# EAGLE design robber_v01 (EAGLE 7.7.0)
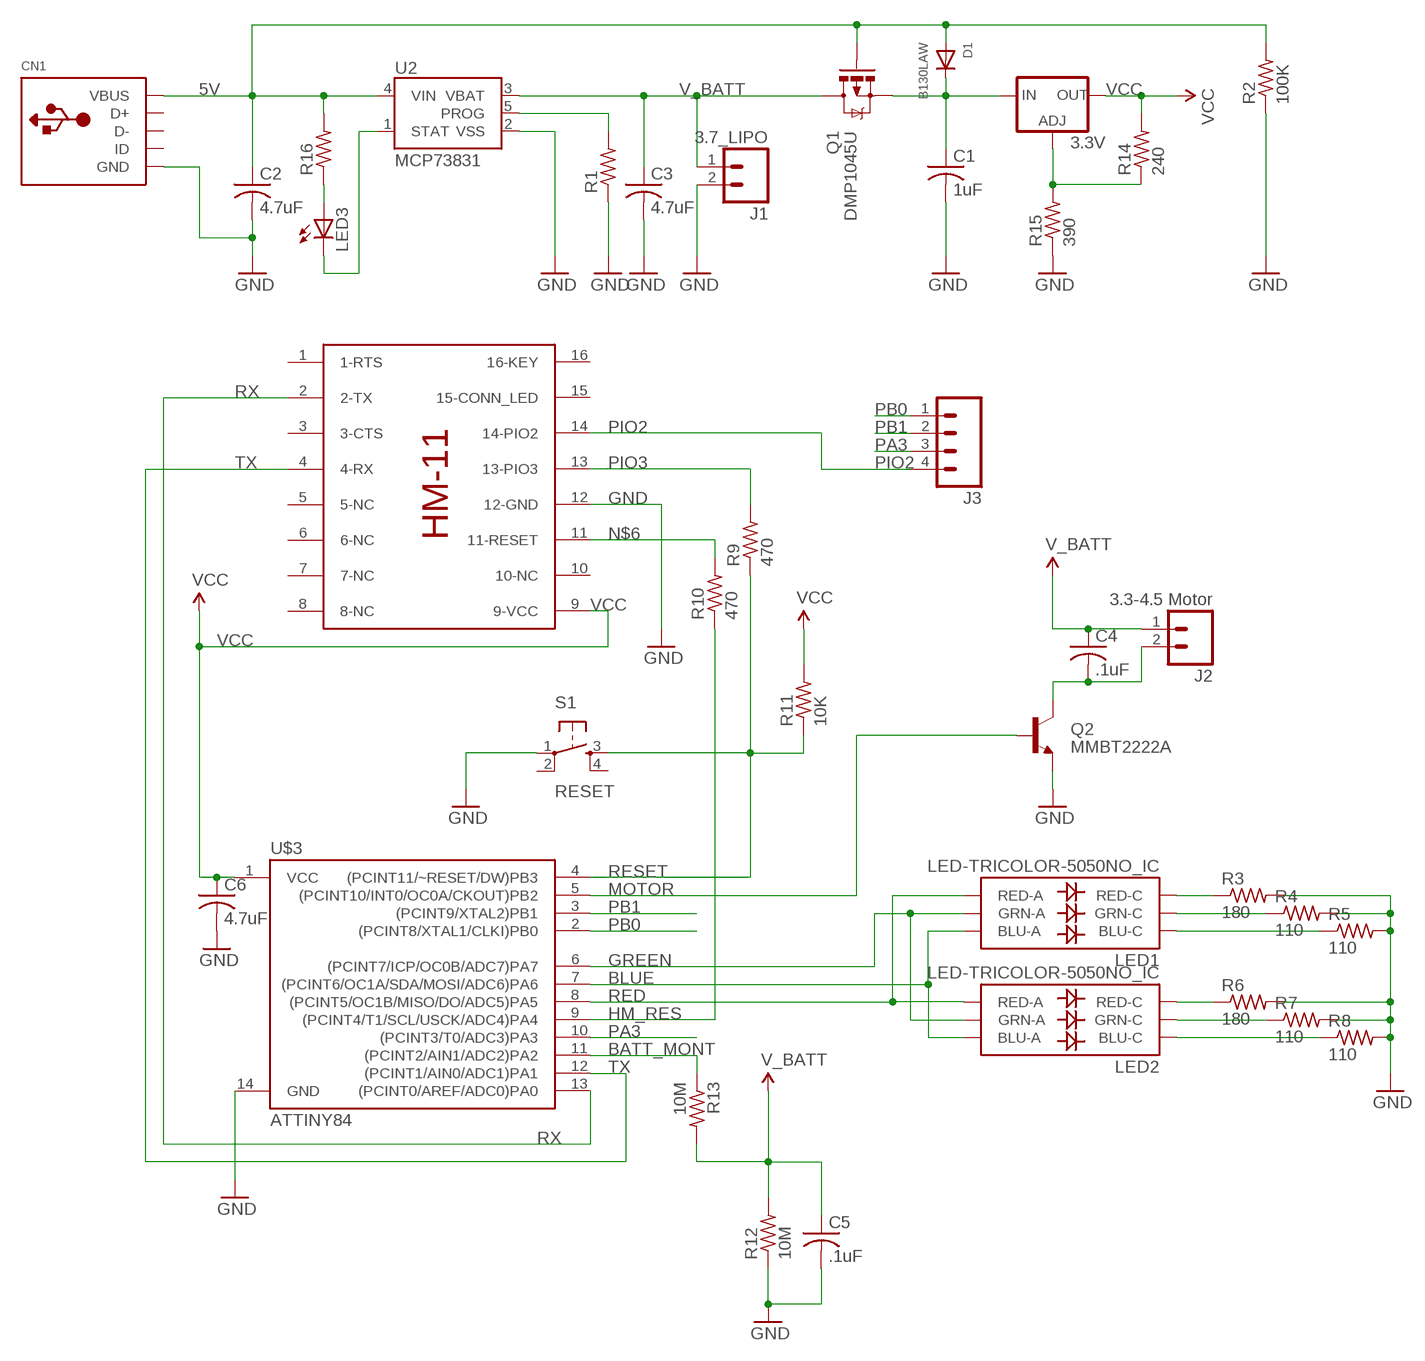
[diagram p0: schematic, sheet 1]

## Parts
3.3V  V_REG_317SMD  [SOT223]
C1  1uF  C-USC0805  [C0805]
C2  4.7uF  C-USC0805  [C0805]
C3  4.7uF  C-USC0805  [C0805]
C4  .1uF  C-USC0805  [C0805]
C5  .1uF  C-USC0805  [C0805]
C6  4.7uF  C-USC0805  [C0805]
CN1  USBMINIB  [USB-MINIB]
D1  B130LAW  DIODESOD-123  [SOD-123]
J1  3.7_LIPO  M02PTH  [1X02]
J2  3.3-4.5 Motor  M02PTH  [1X02]
J3  M04PTH  [1X04]
LED1  LED-TRICOLOR-5050NO_IC  [LED-TRICOLOR-5050]
LED2  LED-TRICOLOR-5050NO_IC  [LED-TRICOLOR-5050]
LED3  LEDSML0603  [SML0603]
Q1  DMP1045U  MOSFET-PCHANNEL  [SOT23-3]
Q2  MMBT2222A  TRANSISTOR_NPNMMBT2222A  [SOT23-3]
R1  R-US_R0805  [R0805]
R2  100K  R-US_R0805  [R0805]
R3  180  R-US_R0805  [R0805]
R4  110  R-US_R0805  [R0805]
R5  110  R-US_R0805  [R0805]
R6  180  R-US_R0805  [R0805]
R7  110  R-US_R0805  [R0805]
R8  110  R-US_R0805  [R0805]
R9  470  R-US_R0805  [R0805]
R10  470  R-US_R0805  [R0805]
R11  10K  R-US_R0805  [R0805]
R12  10M  R-US_R0805  [R0805]
R13  10M  R-US_R0805  [R0805]
R14  240  R-US_R0805  [R0805]
R15  390  R-US_R0805  [R0805]
R16  R-US_R0805  [R0805]
S1  RESET  TAC_SWITCHSMD  [TACTILE-SWITCH-SMD]
U2  MCP73831  [SOT23-5]
U$1  HM-11  [HM-11]
U$3  ATTINY84  [SO14]

## Nets
5V: C2.1 CN1.VBUS D1.A Q1.1(G) R2.2 R16.2 U2.4(VIN)
BATT_MONT: R13.1 U$3.11((PCINT2/AIN1/ADC2)PA2)
BLUE: LED1.3(BLU-A) LED2.3(BLU-A) U$3.7((PCINT6/OC1A/SDA/MOSI/ADC6)PA6)
GND: C1.2 C2.2 C3.2 C5.2 C6.2 CN1.GND CN1.GND1(GND) CN1.GND2(GND) CN1.GND3(GND) CN1.GND4(GND) J1.2 Q2.2(E) R1.1 R2.1 R3.2 R4.2 R5.2 R6.2 R7.2 R8.2 R12.1 R15.1 S1.1 U2.2(VSS) U$1.12(12-GND) U$3.14(GND)
GREEN: LED1.1(GRN-A) LED2.1(GRN-A) U$3.6((PCINT7/ICP/OC0B/ADC7)PA7)
HM_RES: R10.1 U$3.9((PCINT4/T1/SCL/USCK/ADC4)PA4)
MOTOR: Q2.1(B) U$3.5((PCINT10/INT0/OC0A/CKOUT)PB2)
N$1: LED3.A R16.1
N$2: LED3.C U2.1(STAT)
N$6: R10.2 U$1.11(11-RESET)
N$7: C4.2 J2.2 Q2.3(C)
N$9: 3.3V.1(ADJ) R14.1 R15.2
N$18: LED1.5(RED-C) R3.1
N$19: 3.3V.3(IN) C1.1 D1.C Q1.2(S)
N$20: R1.2 U2.5(PROG)
N$21: LED1.6(GRN-C) R4.1
N$23: LED1.4(BLU-C) R5.1
N$27: LED2.5(RED-C) R6.1
N$28: LED2.6(GRN-C) R7.1
N$29: LED2.4(BLU-C) R8.1
PA3: J3.3 U$3.10((PCINT3/T0/ADC3)PA3)
PB0: J3.1 U$3.2((PCINT8/XTAL1/CLKI)PB0)
PB1: J3.2 U$3.3((PCINT9/XTAL2)PB1)
PIO2: J3.4 U$1.14(14-PIO2)
PIO3: R9.2 U$1.13(13-PIO3)
RED: LED1.2(RED-A) LED2.2(RED-A) U$3.8((PCINT5/OC1B/MISO/DO/ADC5)PA5)
RESET: R9.1 R11.1 S1.3 U$3.4((PCINT11/~RESET/DW)PB3)
RX: U$1.2(2-TX) U$3.13((PCINT0/AREF/ADC0)PA0)
TX: U$1.4(4-RX) U$3.12((PCINT1/AIN0/ADC1)PA1)
V_BATT: C3.1 C4.1 C5.1 J1.1 J2.1 Q1.3(D) R12.2 R13.2 U2.3(VBAT)
VCC: 3.3V.2(OUT) C6.1 R11.2 R14.2 U$1.9(9-VCC) U$3.1(VCC)
Unconnected: CN1.D+ CN1.D- CN1.ID S1.2 S1.4 U$1.1(1-RTS) U$1.3(3-CTS) U$1.5(5-NC) U$1.6(6-NC) U$1.7(7-NC) U$1.8(8-NC) U$1.10(10-NC) U$1.15(15-CONN_LED) U$1.16(16-KEY)

## Library data of the parts
3.3V = SparkFun-PowerIC:V_REG_317: Voltage Regulator Standard LM317 adjustable voltage regulator. AOI (Adjust Output Input). Google 'LM317 Calculator' for easy to use app to get the two resistor values needed. 240/720 for 5V output. 240/390 for 3.3V output. Spark Fun Electronics SKU : COM-00527
C1-C6 = resistor:C-US: CAPACITOR, American symbol
CN1 = adafruit:USB: USB Connectors USBMINIB - Surface Mount Female Mini-B USB Connector 4UConnector: 06564 By microbuilder.eu Thru-hole RA Female Mini-B USB Connector 4UConnector: 18732 By ladyada.net
D1 = adafruit:DIODE: Diode SMADIODE - SMA Surface Mount Package 20V 1A Schottky Diode Digikey: 641-1014-6-ND DO-1N4148 - Through Hole Small Current Diode SOD-123 20V 1 A (.5mV Vf) Schottky Diode - Digikey: MBRX120TPMSCT-ND SOD-323 10V 570mA (.38mV Vf, 3ns) Schottky Diode - Digikey: ZLLS410CT-ND SOD-523 30V 30mA Schottky Diode (RB751S-40TE61) - Digikey: RB751S-40TE61CT-ND SOT23-R/W - SOT23 Package (R = Solder Paste/Reflow Ovens, W = Hand-Soldering) BAT54Film 40V 300mA - Digikey: 497-7162-1-ND
J1 J2 = SparkFun-Connectors:M02: Standard 2-pin 0.1" header. Use with - straight break away headers ( PRT-00116) - right angle break away headers (PRT-00553) - swiss pins (PRT-00743) - machine pins (PRT-00117) - female headers (PRT-00115) Molex polarized connector foot print use with: PRT-08233 with associated crimp pins and housings. 2.54_SCREWTERM for use with PRT-10571. 3.5mm Screw Terminal footprints for PRT-08084 5mm Screw Terminal footprints for use with PRT-08432
J3 = SparkFun-Connectors:M04: Header 4 Standard 4-pin 0.1" header. Use with straight break away headers (SKU : PRT-00116), right angle break away headers (PRT-00553), swiss pins (PRT-00743), machine pins (PRT-00117), and female headers (PRT-00115). Molex polarized connector foot print use with SKU : PRT-08231 with associated crimp pins and housings. 1MM SMD Version SKU: PRT-10208; PROD_ID: CONN-09696
LED1 LED2 = SparkFun-LED:LED-TRICOLOR-5050; PROD_ID: DIO-10298
LED3 = led:LED: LED OSRAM: - CHIPLED LG R971, LG N971, LY N971, LG Q971, LY Q971, LO R971, LY R971 LH N974, LH R974 LS Q976, LO Q976, LY Q976 LO Q996 - Hyper CHIPLED LW Q18S LB Q993, LB Q99A, LB R99A - SideLED LS A670, LO A670, LY A670, LG A670, LP A670 LB A673, LV A673, LT A673, LW A673 LH A674 LY A675 LS A676, LA A676, LO A676, LY A676, LW A676 LS A679, LY A679, LG A679 - Hyper Micro SIDELED® LS Y876, LA Y876, LO Y876, LY Y876 LT Y87S - SmartLED LW L88C, LW L88S LB L89C, LB L89S, LG L890 LS L89K, LO L89K, LY L89K LS L896, LA L896, LO L896, LY L896 - TOPLED LS T670, LO T670, LY T670, LG T670, LP T670 LSG T670, LSP T670, LSY T670, LOP T670, LYG T670 LG T671, LOG T671, LSG T671 LB T673, LV T673, LT T673, LW T673 LH T674 LS T676, LA T676, LO T676, LY T676, LB T676, LH T676, LSB T676, LW T676 LB T67C, LV T67C, LT T67C, LS T67K, LO T67K, LY T67K, LW E67C LS E67B, LA E67B, LO E67B, LY E67B, LB E67C, LV E67C, LT E67C LW T67C LS T679, LY T679, LG T679 LS T770, LO T770, LY T770, LG T770, LP T770 LB T773, LV T773, LT T773, LW T773 LH T774 LS E675, LA E675, LY E675, LS T675 LS T776, LA T776, LO T776, LY T776, LB T776 LHGB T686 LT T68C, LB T68C - Hyper Mini TOPLED® LB M676 - Mini TOPLED Santana® LG M470 LS M47K, LO M47K, LY M47K Source: http://www.osram.convergy.de LUXEON: - LUMILED® LXK2-PW12-R00, LXK2-PW12-S00, LXK2-PW14-U00, LXK2-PW14-V00 LXK2-PM12-R00, LXK2-PM12-S00, LXK2-PM14-U00 LXK2-PE12-Q00, LXK2-PE12-R00, LXK2-PE12-S00, LXK2-PE14-T00, LXK2-PE14-U00 LXK2-PB12-K00, LXK2-PB12-L00, LXK2-PB12-M00, LXK2-PB14-N00, LXK2-PB14-P00, LXK2-PB14-Q00 LXK2-PR12-L00, LXK2-PR12-M00, LXK2-PR14-Q00, LXK2-PR14-R00 LXK2-PD12-Q00, LXK2-PD12-R00, LXK2-PD12-S00 LXK2-PH12-R00, LXK2-PH12-S00 LXK2-PL12-P00, LXK2-PL12-Q00, LXK2-PL12-R00 Source: www.luxeon.com KINGBRIGHT: KA-3528ASYC Source: www.kingbright.com
Q1 = SparkFun-DiscreteSemi:MOSFET-PCHANNEL: Generic PMOSFET IRLML2244 - TRANS-11153 (SOT-23 -20V -4.3A) (1.Gate 2.Source 3.Drain) FQP27P06 - COM-10349 <http://www.sparkfun.com/products/10349> (TO-220 -60V -27A) (1.Gate 2.Source 3.Drain); PROD_ID: TRANS-08285
Q2 = SparkFun-DiscreteSemi:TRANSISTOR_NPN: Generic NPN BJT MMBT2222A - TRANS-08049 (SOT-23, 1A 40V) MPSA42 - TRANS-09116 (SOT-23, 500mA 300V) MMBT5088LT1G - TRANS-11160 (SOT-23, 50 mA 30V) BC547 - COM-08928 <http://www.sparkfun.com/products/8928> (TO-92 45V 100mA) (1.Collector 2.Base 3.Emitter) 2N3904 - COM-00521 <http://www.sparkfun.com/products/521> (TO-92 40V 200mA) (1.Emitter 2.Base 3.Collector) P2N2222A - COM-12852 <http://www.sparkfun.com/products/12852> (TO-92 40V 600mA) (1.Collector 2.Base 3.Emitter); PROD_ID: TRANS-08049
R1-R16 = resistor:R-US_: RESISTOR, American symbol
S1 = SparkFun-Retired:TAC_SWITCH: Momentary Switch Button commonly used for reset or general input. Spark Fun Electronics SKU : COM-00097 SMT- SWCH-08247; PROD_ID: SWCH-08247; VALUE: TAC_SWITCHSMD
U2 = SparkFun-PowerIC:MCP73831: Miniature single cell, fully integrated Li-Ion, Li-polymer charge management controller http://ww1.microchip.com/downloads/en/DeviceDoc/20001984g.pdf IC-09995; PROD_ID: IC-09995
U$1 = HM-11-ladvien:HM-11
U$3 = SparkFun-DigitalIC:ATTINY84: Atmel 14-pin 2/4/8kB flash uC; PROD_ID: IC-11285

## Board
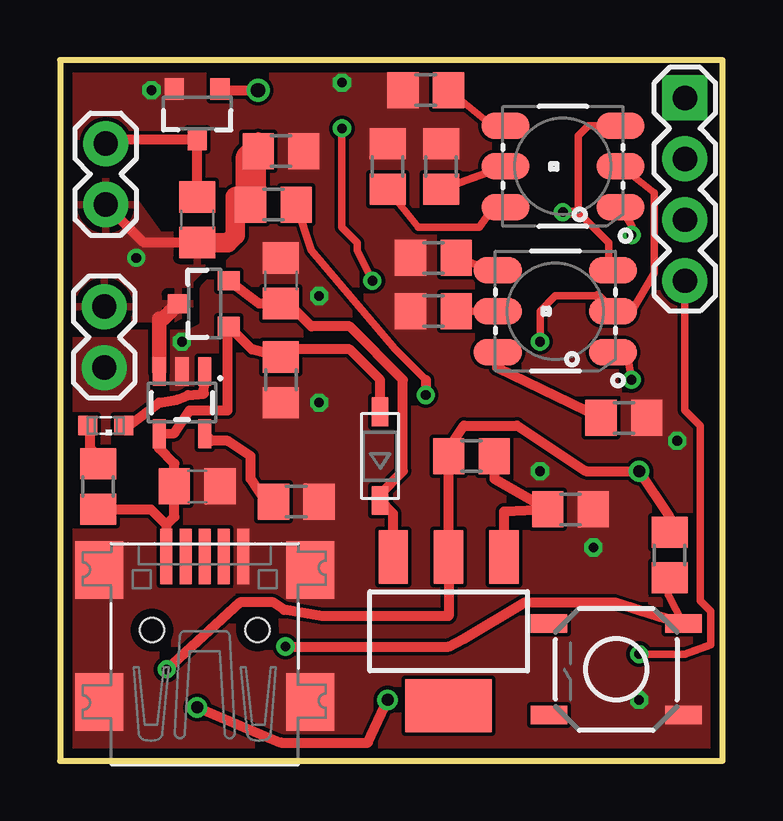
[diagram p1: board, top side]
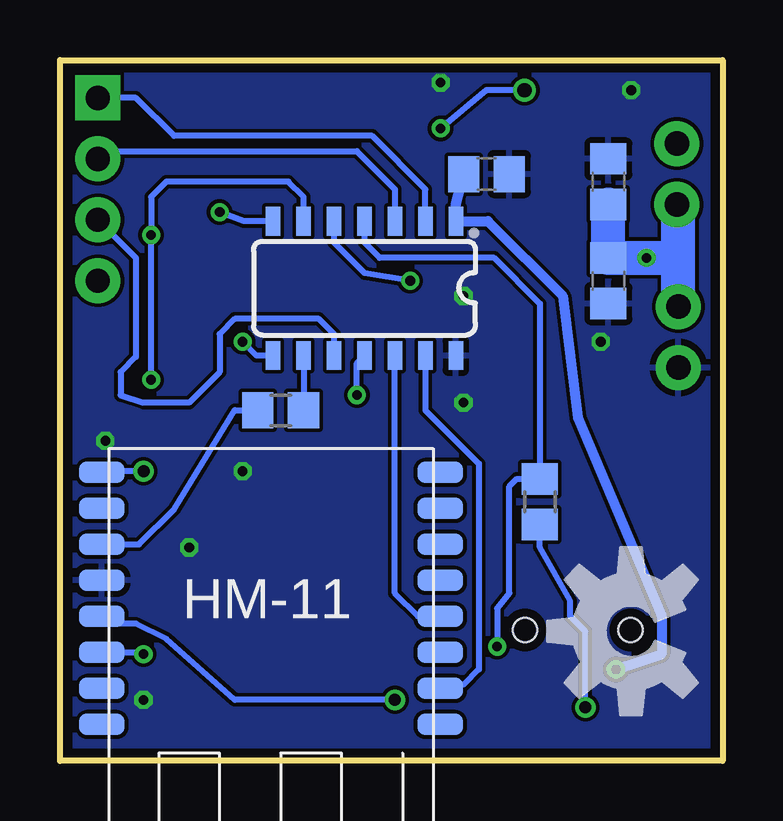
[diagram p2: board, bottom side, seen from below]

Size 27.61 x 29.2 mm. Coordinates in mm from the lower left corner, seen from the top.
Outline: 0,0 27.61,0 27.61,29.2 0,29.2 0,0
Copper layers (1*16): Top 0.0356mm / dielectric 1.5011mm / Bottom 0.0356mm
Design rules "LaenPCBOrder *": minimum track width 6mil, minimum drill 13mil, track to track 6mil, track to pad 6mil, pad to pad 6mil, via to via 6mil, smd to smd 6mil, copper to edge 15mil, drill to drill 6mil, minimum pad ring 7mil, minimum via ring 7mil, stop-mask expansion 3mil, vias tented up to drill 15.74803125mm, thermal gap 10mil

### Footprints (pad centres in the part's own frame; a part is rotated, then mirrored left to right if it is on the bottom)
SOT223 = smd 1.219 x 2.235: 1 -2.311,-3.099; 2 0,-3.099; 3 2.311,-3.099 | smd 3.6 x 2.2: 4 0,3.099
C0805 = smd 1.3 x 1.5: 1 -0.95,0; 2 0.95,0
USB-MINIB = smd 0.5 x 2.308: D+ 0,4.064; D- -0.8,4.064; GND 1.6,4.064; ID 0.8,4.064; VBUS -1.6,4.064 | smd 2 x 2.4: GND1 -4.4,-2; GND2 -4.4,3.5; GND3 4.4,3.5; GND4 4.4,-2 | hole 1: -2.2,1; 2.2,1
SOD-123 = smd 1.2 x 0.7: A 1.85,0; C -1.85,0
1X02 = drill 1.016 pad 1.88: 1 0,0; 2 2.54,0
1X04 = drill 1.016 pad 1.88 square: 1 0,0 | drill 1.016 pad 1.88: 2 2.54,0; 3 5.08,0; 4 7.62,0
LED-TRICOLOR-5050 = smd 2 x 1.1: 1 -2.4,1.7; 2 -2.4,0; 3 -2.4,-1.7; 4 2.4,-1.7; 5 2.4,0; 6 2.4,1.7
SML0603 = smd 0.8 x 0.8: A 0.75,0; C -0.75,0
SOT23-3 = smd 0.8 x 0.9: 1 -0.95,-1; 2 0.95,-1; 3 0,1.1
R0805 = smd 1.3 x 1.5: 1 -0.95,0; 2 0.95,0
TACTILE-SWITCH-SMD = smd 1.524 x 0.762: 1 -2.794,1.905; 2 2.794,1.905; 3 -2.794,-1.905; 4 2.794,-1.905
SOT23-5 = smd 0.55 x 1.2: 1 -0.95,-1.3; 2 0,-1.3; 3 0.95,-1.3; 4 0.95,1.3; 5 -0.95,1.3
HM-11 = smd 1.9 x 0.9: 1 -0.3,11.5; 2 -0.3,10; 3 -0.3,8.5; 4 -0.3,7; 5 -0.3,5.5; 6 -0.3,4; 7 -0.3,2.5; 8 -0.3,1; 9 13.8,1; 10 13.8,2.5; 11 13.8,4; 12 13.8,5.5; 13 13.8,7; 14 13.8,8.5; 15 13.8,10; 16 13.8,11.5
SO14 = smd 0.6 x 1.2: 1 -3.81,-2.8; 2 -2.54,-2.8; 3 -1.27,-2.8; 4 0,-2.8; 5 1.27,-2.8; 6 2.54,-2.8; 7 3.81,-2.8; 8 3.81,2.8; 9 2.54,2.8; 10 1.27,2.8; 11 0,2.8; 12 -1.27,2.8; 13 -2.54,2.8; 14 -3.81,2.8

### Placement (x,y rotation side)
3.3V  16.19,5.4 180 top
C1  9.21,20 90 top
C2  5.71,11.43 0 top
C3  4.76,24.13 90 bottom
C4  5.71,22.54 90 top
C5  4.76,20 270 bottom
C6  9.84,24.45 0 bottom
CN1  6.03,4.45 0 top
D1  13.34,12.7 90 top
J1  1.84,18.92 270 top
J2  1.91,23.18 90 top
J3  26.04,27.62 270 top
LED1  20.64,18.73 180 top
LED2  20.95,24.77 180 top
LED3  1.91,13.97 180 top
Q1  6.03,19.05 90 top
Q2  5.71,26.99 180 top
R1  9.84,10.79 180 top
R2  9.21,15.88 90 top
R3  15.56,18.73 180 top
R4  23.5,14.29 0 top
R5  15.56,20.95 180 top
R6  15.88,24.77 90 top
R7  13.65,24.77 90 top
R8  15.24,27.94 180 top
R9  7.62,10.79 270 bottom
R10  18.41,14.61 180 bottom
R11  25.4,8.57 90 top
R12  9.21,25.4 180 top
R13  8.89,23.18 180 top
R14  17.14,12.7 180 top
R15  21.27,10.48 180 top
R16  1.59,11.43 270 top
S1  23.18,3.81 180 top
U2  5.08,14.92 180 top
U$1  12.06,13.02 180 bottom
U$2  [OSHW-LOGO-L]  3.81,5.4 90 bottom
U$3  14.92,19.68 180 bottom

### Tracks (layer width: path | path; a pad name or v marks a point on that pad's centre or on a via)
5V
  Top 0.406: 4.43,9.83 4.76,10.16 C2.1 4.76,12.38 4.13,13.02 U2.4 4.76,13.65 5.4,14.61 6.99,14.61 6.99,18.05 Q1.1 7.99,17.14 R2.2 9.21,17.14 12.06,17.14 13.34,15.88 D1.A | 4.43,9.83 CN1.VBUS | R16.2 3.78,10.48 4.43,9.83
BATT_MONT  (via drill 0.4 pad 0.25)
  Top 0.305: R13.1 10.47,21.27 13.97,17.14 15.24,15.88
  Top 0.406: 15.24,15.88 v15.24,15.24
  Bottom 0.254: v15.24,15.24 15.24,16.57 U$3.11
BLUE  (via drill 0.4 pad 0.25)
  Top 0.305: LED2.3 22.02,26.46 21.59,26.04 21.59,22.86 22.86,21.59 22.86,20.61
  Top 0.406: v20.95,22.86 21.59,22.86 | 22.86,20.61 LED1.3
  Bottom 0.254: U$3.7 19.95,22.48 v20.95,22.86
GND  (via drill 0.4)
  other vias: 10.79,14.92 25.72,13.34 3.81,27.94 10.79,19.37 11.75,28.26 24.13,2.54 22.23,8.89 20,12.06 5.08,17.46
  pour Bottom: 0,0 -0.32,29.21 27.94,29.21 27.94,0
  pour Top (no thermals): 0,0 0,17.46 2.54,17.46 2.86,17.78 5.4,17.78 6.03,18.1 6.03,19.68 7.3,20.95 7.3,22.23 6.67,22.86 4.76,22.86 2.86,24.77 0,24.77 -0.32,29.84 27.94,29.84 27.94,0
GREEN  (via drill 0.4 pad 0.25)
  Top 0.305: LED1.1 23.61,17.03 v23.81,15.88 | v23.81,21.91 23.81,22.29 LED2.1
  Bottom 0.254: v23.81,15.88 v23.81,21.91 23.81,23.5 23.18,24.13 18.1,24.13 17.46,23.5 U$3.6
HM_RES
  Bottom 0.254: U$3.9 17.46,14.92 R10.1
MOTOR  (via drill 0.4 pad 0.25, 0.6)
  Top 0.305: v11.75,26.35 11.75,22.23 12.38,21.59 12.38,21.27 v13.02,20
  Top 0.406: Q2.1 6.71,27.94 v8.26,27.94
  Bottom 0.254: v8.26,27.94 9.84,27.94 v11.75,26.35 | v13.02,20 14.92,20.32 16.19,21.59 U$3.5
N$1
  Top 0.406: R16.1 1.59,12.7 1.27,13.02 1.27,13.86 LED3.A
N$2
  Top 0.406: LED3.C 2.86,13.97 4.13,14.92 4.89,15.05 5.33,15.24 6,15.3 U2.1
N$6
  Bottom 0.254: U$1.11 24.32,9.02 22.86,10.48 20.32,14.61 R10.2
N$7
  Top 0.406: C4.2 Q2.3 2.08,25.89 J2.2
N$9
  Top 0.406: R14.1 18.1,11.74 R15.2 18.5,10.39 3.3V.1
N$18
  Top 0.305: 18.1,18.73 17.46,18.73 R3.1
  Top 0.406: LED1.5 18.1,18.73
N$19
  Top 0.406: 3.3V.3 13.88,10.3 D1.C 13.34,11.11 14.29,12.06 14.29,15.88 12.06,18.1 10.48,18.1 9.53,19.05 9.53,19.37 C1.1 8.3,19.05 Q1.2
N$20
  Top 0.406: R1.2 8.57,10.79 7.94,11.75 7.94,12.7 6.99,13.34 6.32,13.34 U2.5
N$21
  Top 0.406: LED1.6 18.21,16.4 R4.1
N$23
  Top 0.305: 17.98,20.11 17.46,20.64 R5.1
  Top 0.406: LED1.4 17.98,20.11
N$27
  Top 0.305: R6.1 LED2.5
N$28
  Top 0.305: R7.1 14.92,22.23 17.46,22.23 18.12,23.18 LED2.6
N$29
  Top 0.305: R8.1 18.12,26.35 LED2.4
PA3
  Bottom 0.254: J3.3 24.45,20.95 24.45,16.83 25.08,16.19 25.08,15.24 24.13,14.92 22.23,14.92 20.95,16.19 20.95,17.78 20.32,18.41 16.83,18.41 16.19,17.78 U$3.10
PB0
  Bottom 0.254: U$3.2 12.38,23.81 14.61,26.04 22.86,26.04 24.45,27.62 J3.1
PB1
  Bottom 0.254: J3.2 25.72,25.4 15.24,25.4 13.65,23.81 U$3.3
PIO2  (via drill 0.4 pad 0.25)
  Top 0.305: J3.4 26.04,14.61 26.67,13.97 26.67,6.67 27.11,6.22 27.11,4.83 26.04,4.45 v24.13,4.45
  Bottom 0.254: U$1.14 24.2,4.52 v24.13,4.45
PIO3  (via drill 0.5, 0.5 pad 0.25)
  Top 0.406: v5.71,2.22 9.21,0.76 12.83,0.76 v13.65,2.54
  Bottom 0.254: v13.65,2.54 20.32,2.54 23.18,5.08 24.45,5.71 25.56,5.71 U$1.13 | v5.71,2.22 5.71,5.4 6.35,6.03 6.35,6.67 7.62,8.89 R9.2
RED  (via drill 0.4 pad 0.25)
  Top 0.305: LED1.2 23.81,18.73 24.77,20.32 24.77,23.67 LED2.2 | v20,17.46 20,18.73 20.64,19.37 22.4,19.37
  Top 0.406: 22.4,19.37 LED1.2
  Bottom 0.254: U$3.8 19.43,16.89 v20,17.46
RESET  (via drill 0.4 pad 0.25)
  Top 0.305: S1.3 25.34,6.92 R11.1
  Top 0.406: v9.4,4.76 16.19,4.76 16.83,5.08 19.37,6.6 23.11,6.6 S1.3
  Bottom 0.254: U$3.4 14.92,21.59 14.29,20.95 9.53,20.95 7.62,19.05 R9.1 8.57,11.75 8.89,11.43 8.89,6.99 9.4,6.35 v9.4,4.76
RX
  Bottom 0.254: U$3.13 12.38,14.61 10.16,12.38 10.16,3.81 10.79,3.17 11.61,3.17 U$1.2
TX
  Bottom 0.254: U$1.4 12.69,6.02 13.65,6.99 U$3.12
V_BATT  (via drill 0.4 pad 0.25)
  Top 0.305: 4.13,18.41 4.3,18.41 | R12.2 8.26,26.04
  Top 0.406: C4.1 3.49,21.59 J2.1 | R13.2 7.3,23.5 | 7.94,25.08 R12.2 | 4.1,16.19 U2.3
  Top 0.61: U2.3 4.13,18.41 | 4.3,18.41 Q1.3
  Top 0.813: C4.1 6.99,21.59 7.3,21.91 7.3,23.5
  Top 1.27: 7.94,25.08 R13.2
  Bottom 0.305: 1.91,20.95 | 1.84,22.99 J2.1
  Bottom 1.27: C5.1 3.5,20.95 v3.17,20.95
  Bottom 1.422: C3.1 C5.1 1.91,20.95 | J1.1 1.84,22.99
  pour Top: 0.32,18.41 0.32,24.13 2.54,24.13 4.13,21.91 6.35,21.91 6.35,20.95 5.4,20 5.4,18.73 4.76,18.41
VCC  (via drill 0.4 pad 0.25, 0.5)
  Top 0.406: R11.2 25.4,10.16 v24.13,12.06 21.91,12.06 19.05,13.97 16.83,13.97 16.2,13.02 R14.2 3.3V.2 16.19,6.03 10.92,6.03 9.34,6.29 8.89,6.6 7.49,6.6 v4.45,3.81
  Bottom 0.254: v24.13,12.06 25.82,12.06 U$1.9
  Bottom 0.406: C6.1 11.11,23.18 U$3.1 9.79,22.48 6.67,19.37 6.03,14.29 2.54,6.03 2.54,4.45 v4.45,3.81

### Text on the board
_bsilk: PB0 | GND | PB1 | PA3 | VBAT | PI02 | GND | Robber Board v01 / C. Thomas Brittain (C) / www.ladvien.com